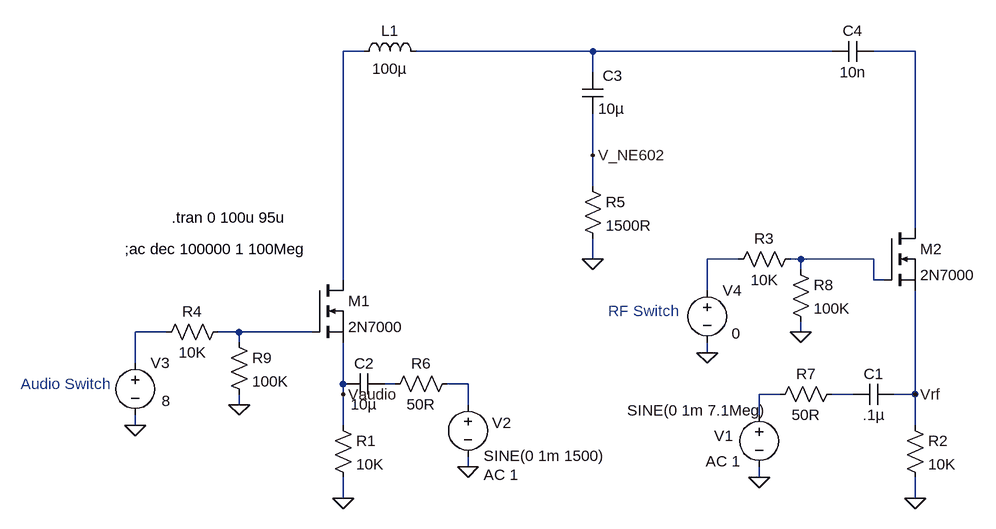
[diagram p0: schematic FET Switch Test.asc]
FET Switch Test.asc, the LTspice schematic file:
Version 4
SHEET 1 1264 808
WIRE 192 -416 160 -416
WIRE 544 -416 272 -416
WIRE 912 -416 544 -416
WIRE 1040 -416 976 -416
WIRE 544 -384 544 -416
WIRE 544 -256 544 -320
WIRE 544 -208 544 -256
WIRE 1040 -144 1040 -416
WIRE 544 -96 544 -128
WIRE 768 -96 720 -96
WIRE 864 -96 848 -96
WIRE 976 -96 864 -96
WIRE 864 -80 864 -96
WIRE 160 -64 160 -416
WIRE 976 -64 976 -96
WIRE 992 -64 976 -64
WIRE 720 -48 720 -96
WIRE -112 16 -160 16
WIRE 0 16 -32 16
WIRE 112 16 0 16
WIRE 864 16 864 0
WIRE 0 32 0 16
WIRE 720 48 720 32
WIRE -160 64 -160 16
WIRE 160 96 160 32
WIRE 240 96 224 96
WIRE 352 96 320 96
WIRE 160 112 160 96
WIRE 832 112 800 112
WIRE 944 112 912 112
WIRE 1040 112 1040 -48
WIRE 1040 112 1008 112
WIRE 0 128 0 112
WIRE 352 128 352 96
WIRE 800 144 800 112
WIRE -160 160 -160 144
WIRE 160 160 160 112
WIRE 1040 160 1040 112
WIRE 352 224 352 208
WIRE 800 240 800 224
WIRE 160 272 160 240
WIRE 1040 272 1040 240
FLAG 160 272 0
FLAG 352 224 0
FLAG 1040 272 0
FLAG -160 160 0
FLAG 720 48 0
FLAG 1040 112 Vrf
FLAG 160 112 Vaudio
FLAG 800 240 0
FLAG 544 -96 0
FLAG 544 -256 V_NE602
FLAG 864 16 0
FLAG 0 128 0
SYMBOL nmos 112 -64 R0
SYMATTR InstName M1
SYMATTR Value 2N7000
SYMBOL voltage 800 128 R0
WINDOW 3 -203 9 Left 2
WINDOW 123 -82 87 Left 2
WINDOW 39 0 0 Left 2
WINDOW 0 -69 48 Left 2
SYMATTR Value SINE(0 1m 7.1Meg)
SYMATTR Value2 AC 1
SYMATTR InstName V1
SYMBOL res 144 144 R0
SYMATTR InstName R1
SYMATTR Value 10K
SYMBOL res 1024 144 R0
SYMATTR InstName R2
SYMATTR Value 10K
SYMBOL voltage -160 48 R0
WINDOW 3 41 74 Left 2
WINDOW 123 24 124 Left 2
WINDOW 39 0 0 Left 2
SYMATTR Value 8
SYMATTR InstName V3
SYMBOL voltage 720 -64 R0
WINDOW 3 38 82 Left 2
WINDOW 123 24 124 Left 2
WINDOW 39 0 0 Left 2
SYMATTR Value 0
SYMATTR InstName V4
SYMBOL res 864 -112 R90
WINDOW 0 0 56 VBottom 2
WINDOW 3 32 56 VTop 2
SYMATTR InstName R3
SYMATTR Value 10K
SYMBOL res -16 0 R90
WINDOW 0 0 56 VBottom 2
WINDOW 3 32 56 VTop 2
SYMATTR InstName R4
SYMATTR Value 10K
SYMBOL cap 1008 96 R90
WINDOW 0 0 32 VBottom 2
WINDOW 3 32 32 VTop 2
SYMATTR InstName C1
SYMATTR Value .1µ
SYMBOL cap 224 80 R90
WINDOW 0 0 32 VBottom 2
WINDOW 3 32 32 VTop 2
SYMATTR InstName C2
SYMATTR Value 10µ
SYMBOL nmos 992 -144 R0
SYMATTR InstName M2
SYMATTR Value 2N7000
SYMBOL voltage 352 112 R0
WINDOW 3 24 95 Left 2
WINDOW 123 24 124 Left 2
WINDOW 39 0 0 Left 2
WINDOW 0 37 44 Left 2
SYMATTR Value SINE(0 1m 1500)
SYMATTR Value2 AC 1
SYMATTR InstName V2
SYMBOL ind 176 -400 R270
WINDOW 0 32 56 VTop 2
WINDOW 3 5 56 VBottom 2
SYMATTR InstName L1
SYMATTR Value 100µ
SYMBOL cap 528 -384 R0
WINDOW 0 31 5 Left 2
SYMATTR InstName C3
SYMATTR Value 10µ
SYMBOL res 528 -224 R0
SYMATTR InstName R5
SYMATTR Value 1500R
SYMBOL cap 976 -432 R90
WINDOW 0 0 32 VBottom 2
WINDOW 3 32 32 VTop 2
SYMATTR InstName C4
SYMATTR Value 10n
SYMBOL res 336 80 R90
WINDOW 0 0 56 VBottom 2
WINDOW 3 32 56 VTop 2
SYMATTR InstName R6
SYMATTR Value 50R
SYMBOL res 928 96 R90
WINDOW 0 0 56 VBottom 2
WINDOW 3 32 56 VTop 2
SYMATTR InstName R7
SYMATTR Value 50R
SYMBOL res 848 -96 R0
SYMATTR InstName R8
SYMATTR Value 100K
SYMBOL res -16 16 R0
SYMATTR InstName R9
SYMATTR Value 100K
TEXT -104 -160 Left 2 !.tran 0 100u 95u
TEXT -176 -112 Left 2 !;ac dec 100000 1 100Meg
TEXT -336 96 Left 2 ;Audio Switch
TEXT 568 -16 Left 2 ;RF Switch

The netlist it stands for:
* FET Switch Test.asc
M1 N001 N007 Vaudio Vaudio 2N7000
V1 N010 0 SINE(0 1m 7.1Meg) AC 1
R1 Vaudio 0 10K
R2 Vrf 0 10K
V3 N006 0 8
V4 N004 0 0
R3 N005 N004 10K
R4 N007 N006 10K
C1 Vrf N011 .1µ
C2 N008 Vaudio 10µ
M2 N003 N005 Vrf Vrf 2N7000
V2 N009 0 SINE(0 1m 1500) AC 1
L1 N001 N002 100µ
C3 N002 V_NE602 10µ
R5 V_NE602 0 1500R
C4 N003 N002 10n
R6 N009 N008 50R
R7 N011 N010 50R
R8 N005 0 100K
R9 N007 0 100K
.model NMOS NMOS
.model PMOS PMOS
.lib standard.mos
.tran 0 100u 95u
;ac dec 100000 1 100Meg
* Audio Switch
* RF Switch
.backanno
.end